# Altium schematic sheet Peripheral.SchDoc
size A3; SheetNumber: 5; SheetTotal: 6; ProjectTitle: PD_SMARTKEY_EMN-EVAN_V2
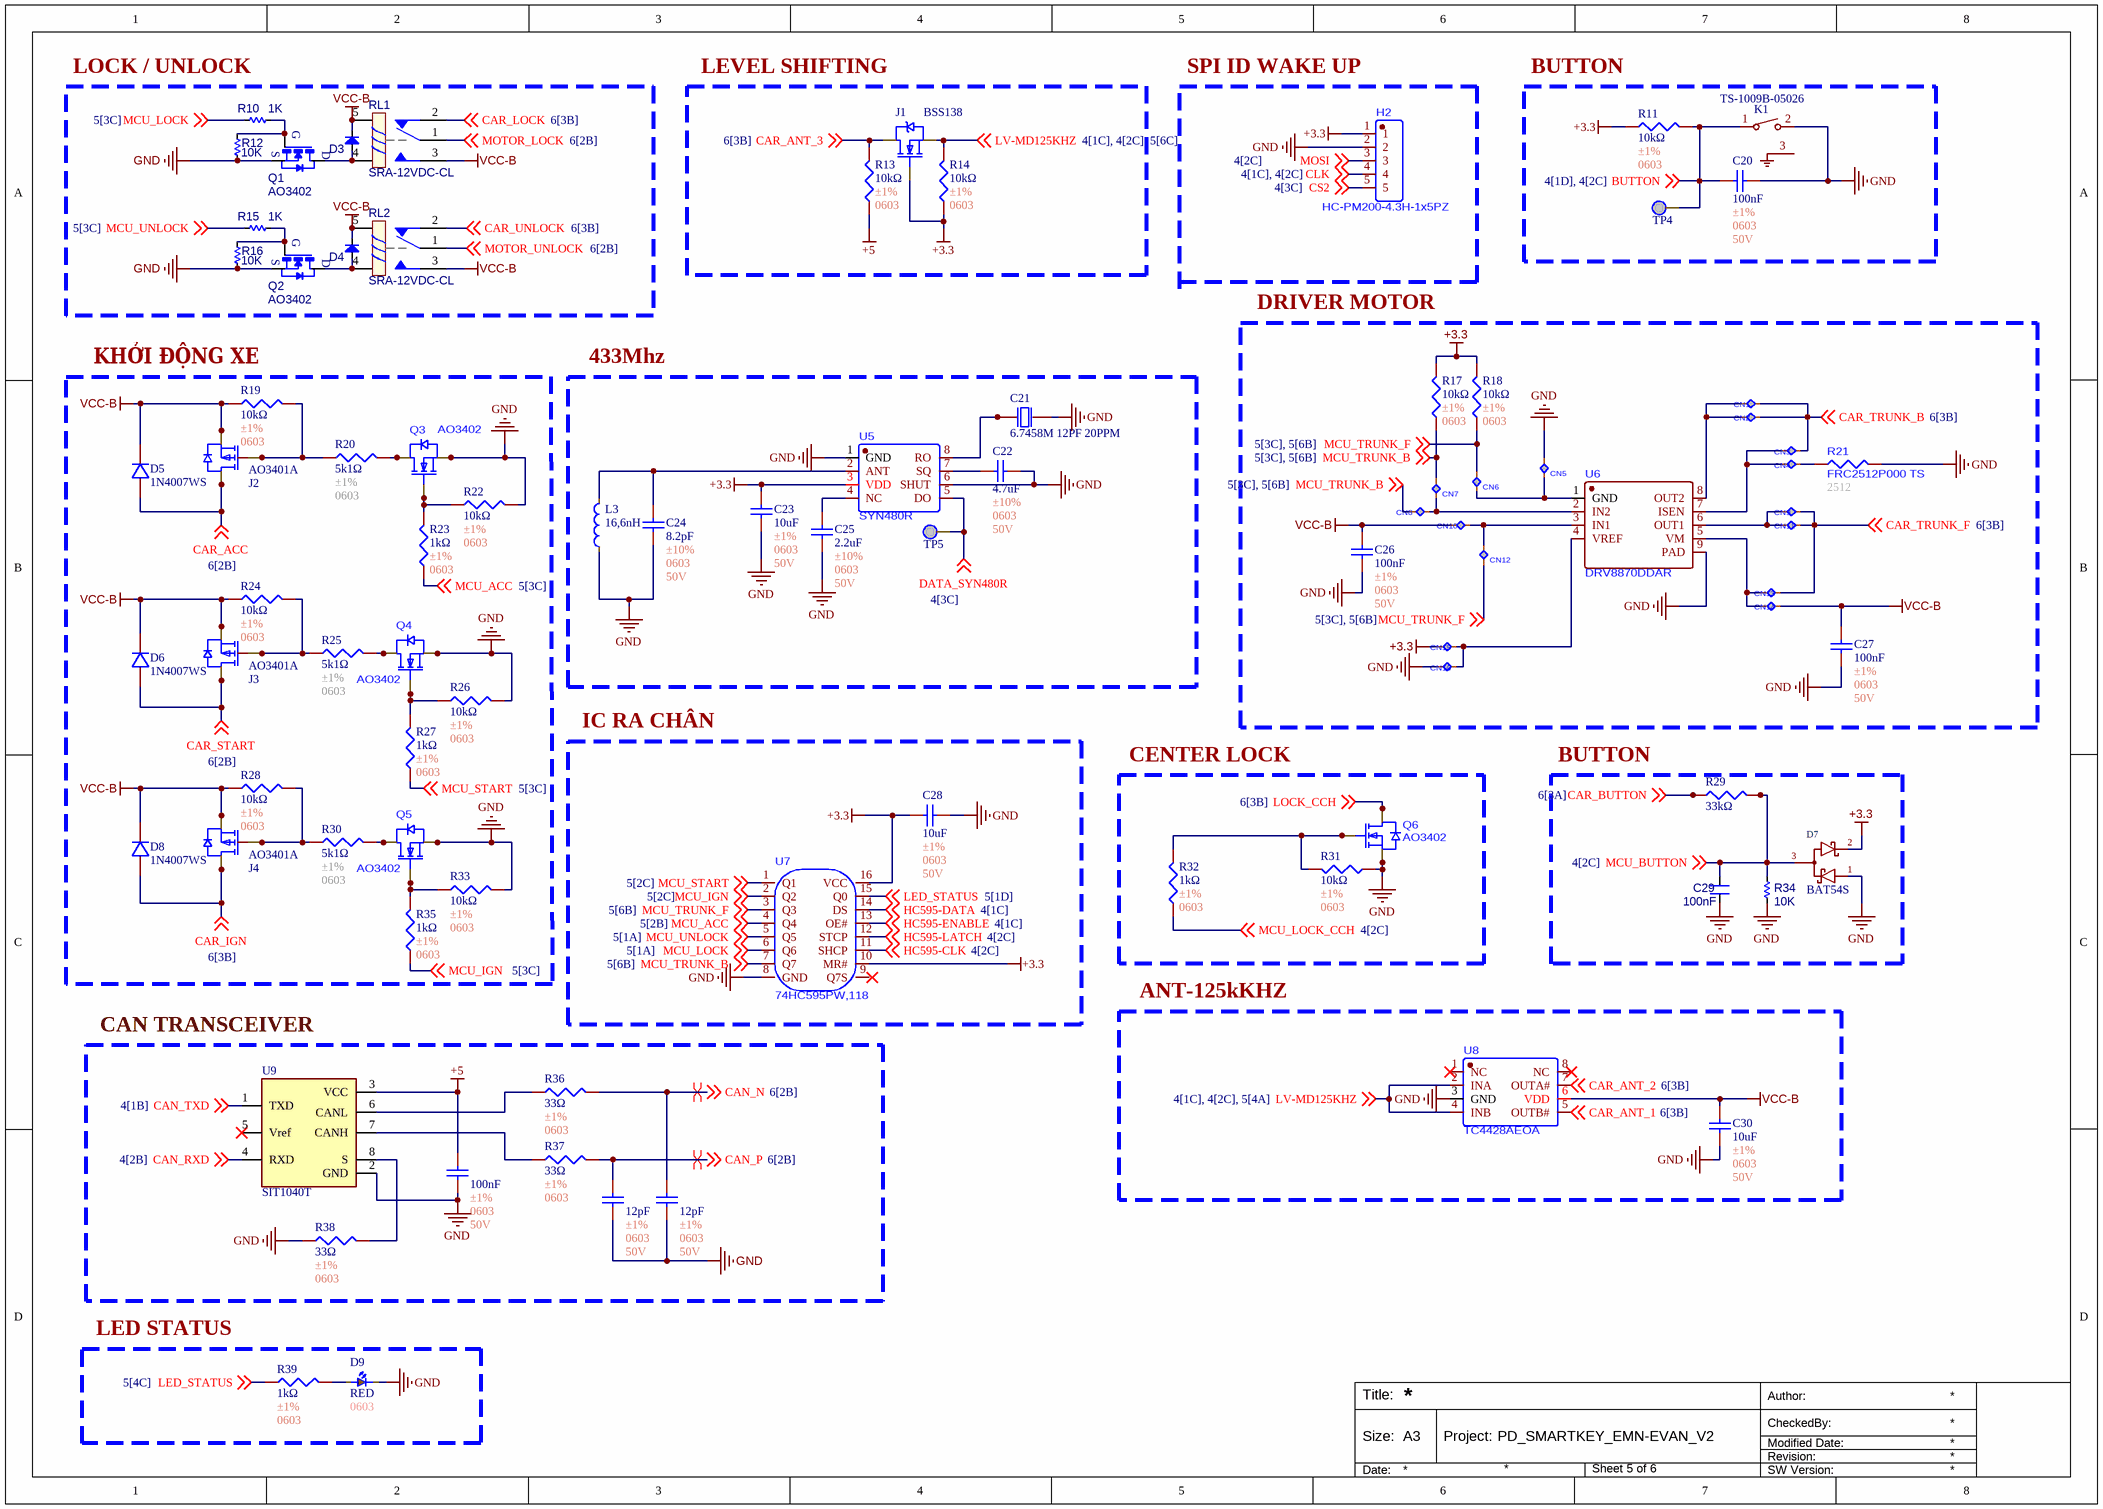
[diagram p0: Peripheral.SchDoc]

## Parts
C20  100nF  Tolerance: ±1%  Package: 0603  Voltage Rating: 50V  [C0603]
C21  6.7458M 12PF 20PPM  [6.7458M 12PF 20PPM]
C22  4.7uF  Tolerance: ±10%  Package: 0603  Voltage Rating: 50V  [C0603]
C23  10uF  Tolerance: ±1%  Package: 0603  Voltage Rating: 50V  [C0603]
C24  8.2pF  Tolerance: ±10%  Package: 0603  Voltage Rating: 50V  [C0603]
C25  2.2uF  Tolerance: ±10%  Package: 0603  Voltage Rating: 50V  [C0603]
C26  100nF  Tolerance: ±1%  Package: 0603  Voltage Rating: 50V  [C0603]
C27  100nF  Tolerance: ±1%  Package: 0603  Voltage Rating: 50V  [C0603]
C28  10uF  Tolerance: ±1%  Package: 0603  Voltage Rating: 50V  [C0603]
C29  100nF  [C-0603]
C30  10uF  Tolerance: ±1%  Package: 0603  Voltage Rating: 50V  [C0603]
C31  100nF  Tolerance: ±1%  Package: 0603  Voltage Rating: 50V  [C0603]
C32  12pF  Tolerance: ±1%  Package: 0603  Voltage Rating: 50V  [C0603]
C33  12pF  Tolerance: ±1%  Package: 0603  Voltage Rating: 50V  [C0603]
CN1  CN  [CN]  (value not drawn)
CN2  CN  [CN]  (value not drawn)
CN3  CN  [CN]  (value not drawn)
CN4  CN  [CN]  (value not drawn)
CN5  CN  [CN]  (value not drawn)
CN6  CN  [CN]  (value not drawn)
CN7  CN  [CN]  (value not drawn)
CN8  CN  [CN]  (value not drawn)
CN9  CN  [CN]  (value not drawn)
CN10  CN  [CN]  (value not drawn)
CN11  CN  [CN]  (value not drawn)
CN12  CN  [CN]  (value not drawn)
CN13  CN  [CN]  (value not drawn)
CN14  CN  [CN]  (value not drawn)
CN15  CN  [CN]  (value not drawn)
CN16  CN  [CN]  (value not drawn)
D3  1N5819  [SOD-323]  (value not drawn)
D4  1N5819  [SOD-323]  (value not drawn)
D5  1N4007WS  [1N4007WS]
D6  1N4007WS  [1N4007WS]
D7  BAT54S  [SOT23-3]
D8  1N4007WS  [1N4007WS]
D9  RED  Package: 0603  [LED0603]
H2  HC-PM200-4.3H-1x5PZ  [JC_5P_XH2.0]
J1  BSS138  [BSS138]
J2  AO3401A  [AO3401]
J3  AO3401A  [AO3401]
J4  AO3401A  [AO3401]
K1  TS-1009B-05026  [TS-1009B-05026]
L3  16,6nH  [L_16,6nH_0603]
Q1  AO3402  [SOT23-3]
Q2  AO3402  [SOT23-3]
Q3  AO3402  [AO3402]
Q4  AO3402  [AO3402]
Q5  AO3402  [AO3402]
Q6  AO3402  [AO3402]
R10  1K  [RES-SMD-0603]
R11  10kΩ  Tolerance: ±1%  Package: 0603  [R0603]
R12  10K  [RES-SMD-0603]
R13  10kΩ  Tolerance: ±1%  Package: 0603  [R0603]
R14  10kΩ  Tolerance: ±1%  Package: 0603  [R0603]
R15  1K  [RES-SMD-0603]
R16  10K  [RES-SMD-0603]
R17  10kΩ  Tolerance: ±1%  Package: 0603  [R0603]
R18  10kΩ  Tolerance: ±1%  Package: 0603  [R0603]
R19  10kΩ  Tolerance: ±1%  Package: 0603  [R0603]
R20  5k1Ω  Tolerance: ±1%  Package: 0603  [R0603]
R21  FRC2512P000 TS  Packaging: 2512  [R_2512_0O ±5%]
R22  10kΩ  Tolerance: ±1%  Package: 0603  [R0603]
R23  1kΩ  Tolerance: ±1%  Package: 0603  [R0603]
R24  10kΩ  Tolerance: ±1%  Package: 0603  [R0603]
R25  5k1Ω  Tolerance: ±1%  Package: 0603  [R0603]
R26  10kΩ  Tolerance: ±1%  Package: 0603  [R0603]
R27  1kΩ  Tolerance: ±1%  Package: 0603  [R0603]
R28  10kΩ  Tolerance: ±1%  Package: 0603  [R0603]
R29  33kΩ  [R0603]
R30  5k1Ω  Tolerance: ±1%  Package: 0603  [R0603]
R31  10kΩ  Tolerance: ±1%  Package: 0603  [R0603]
R32  1kΩ  Tolerance: ±1%  Package: 0603  [R0603]
R33  10kΩ  Tolerance: ±1%  Package: 0603  [R0603]
R34  10K  [RES-SMD-0603]
R35  1kΩ  Tolerance: ±1%  Package: 0603  [R0603]
R36  33Ω  Tolerance: ±1%  Package: 0603  [R0603]
R37  33Ω  Tolerance: ±1%  Package: 0603  [R0603]
R38  33Ω  Tolerance: ±1%  Package: 0603  [R0603]
R39  1kΩ  Tolerance: ±1%  Package: 0603  [R0603]
RL1  SRA-12VDC-CL  [YL318-DC12V-C]
RL2  SRA-12VDC-CL  [YL318-DC12V-C]
TP4  TP  [TP]  (value not drawn)
TP5  TP  [TP]  (value not drawn)
U5  SYN480R  [SYN480R]
U6  DRV8870DDAR  [DRV8870DDAR]
U7  74HC595PW,118  [74HC595PW,118]
U8  TC4428AEOA  [TC4428AEOA]
U9  SIT1040T  [SO8]

## Blocks framed on the sheet
LOCK / UNLOCK: D3 D4 Q1 Q2 R10 R12 R15 R16 RL1 RL2
LEVEL SHIFTING: J1 R13 R14
BUTTON: C20 K1 R11 TP4
DRIVER MOTOR: C26 C27 CN1-CN16 R17 R18 R21 U6
KHỞI ĐỘNG XE: D5 D6 D8 J2-J4 Q3-Q5 R19 R20 R22-R28 R30 R33 R35
433Mhz: C21-C25 L3 TP5 U5
IC RA CHÂN: C28 U7
CENTER LOCK: Q6 R31 R32
BUTTON: C29 D7 R29 R34
ANT-125kKHZ: C30 U8
CAN TRANSCEIVER: C31-C33 R36-R38 U9

## Nets
+3.3: C23.1 C28.1 CN15.1 D7.2(C) H2.1 J1.1(G) R11.1 R14.1 R17.2 R18.2 U5.3(VDD) U7.10(MR#) U7.16(VCC)
+5: C31.1 R13.1 U9.3(VCC)
GND: C20.1 C21.2(OSC2) C22.2 C23.2 C24.2 C25.2 C26.2 C27.2 C28.2 C29.1 C30.2 C31.2 C32.2 C33.2 CN5.1 CN16.1 D7.1(A) D9.1 H2.2 K1.2 L3.1 Q1.2(S) Q2.2(S) Q3.2(S) Q4.2(S) Q5.2(S) Q6.2(S) R12.1 R16.1 R21.2 R22.2 R26.2 R31.1 R33.2 R34.1 R38.1 U5.1(GND) U5.6(SHUT) U6.9(PAD) U7.8(GND) U8.3(GND) U9.2(GND)
VCC-B: C26.1 C27.1 C30.1 CN10.1 CN14.2 D3.2(K) D4.2(K) D5.1(K) D6.1(K) D8.1(K) J2.2(S) J3.2(S) J4.2(S) R19.1 R24.1 R28.1 RL1.3 RL1.5 RL2.3 RL2.5 U8.6(VDD)
BUTTON: C20.2 K1.1 R11.2 TP4.1 ; off-sheet BUTTON
CAN_N: C33.1 R36.2 ; off-sheet CAN_N
CAN_P: C32.1 R37.2 ; off-sheet CAN_P
CAN_RXD: U9.4(RXD) ; off-sheet CAN_RXD
CAN_TXD: U9.1(TXD) ; off-sheet CAN_TXD
CAR_ACC: D5.2(A) J2.3(D) ; off-sheet CAR_ACC
CAR_ANT_1: U8.5(OUTB#) ; off-sheet CAR_ANT_1
CAR_ANT_2: U8.7(OUTA#) ; off-sheet CAR_ANT_2
CAR_ANT_3: J1.3(D) R13.2 ; off-sheet CAR_ANT_3
CAR_BUTTON: R29.1 ; off-sheet CAR_BUTTON
CAR_IGN: D8.2(A) J4.3(D) ; off-sheet CAR_IGN
CAR_LOCK: RL1.2 ; off-sheet CAR_LOCK
CAR_START: D6.2(A) J3.3(D) ; off-sheet CAR_START
CAR_TRUNK_B: CN1.2 CN2.2 CN3.2 ; off-sheet CAR_TRUNK_B
CAR_TRUNK_F: CN9.2 CN11.2 CN13.2 ; off-sheet CAR_TRUNK_F
CAR_UNLOCK: RL2.2 ; off-sheet CAR_UNLOCK
CLK: H2.4 ; off-sheet CLK
CS2: H2.5 ; off-sheet CS2
DATA_SYN480R: TP5.1 U5.5(DO) ; off-sheet DATA_SYN480R
HC595-CLK: U7.11(SHCP) ; off-sheet HC595-CLK
HC595-DATA: U7.14(DS) ; off-sheet HC595-DATA
HC595-ENABLE: U7.13(OE#) ; off-sheet HC595-ENABLE
HC595-LATCH: U7.12(STCP) ; off-sheet HC595-LATCH
LED_STATUS: R39.1 U7.15(Q0) ; off-sheet LED_STATUS
LOCK_CCH: Q6.3(D) ; off-sheet LOCK_CCH
LV-MD125KHZ: J1.2(S) R14.2 U8.2(INA) U8.4(INB) ; off-sheet LV-MD125KHZ
MCU_ACC: R23.1 U7.4(Q4) ; off-sheet MCU_ACC
MCU_BUTTON: C29.2 D7.3 R29.2 R34.2 ; off-sheet MCU_BUTTON
MCU_IGN: R35.1 U7.2(Q2) ; off-sheet MCU_IGN
MCU_LOCK: R10.2 U7.6(Q6) ; off-sheet MCU_LOCK
MCU_LOCK_CCH: R32.1 ; off-sheet MCU_LOCK_CCH
MCU_START: R27.1 U7.1(Q1) ; off-sheet MCU_START
MCU_TRUNK_B: CN7.1 CN8.1 R17.1 U7.7(Q7) ; off-sheet MCU_TRUNK_B
MCU_TRUNK_F: CN6.1 CN12.1 R18.1 U7.3(Q3) ; off-sheet MCU_TRUNK_F
MCU_UNLOCK: R15.2 U7.5(Q5) ; off-sheet MCU_UNLOCK
MOSI: H2.3 ; off-sheet MOSI
MOTOR_LOCK: RL1.1 ; off-sheet MOTOR_LOCK
MOTOR_UNLOCK: RL2.1 ; off-sheet MOTOR_UNLOCK
NetC21_1: C21.1(OSC1) U5.8(RO)
NetC22_1: C22.1 U5.7(SQ)
NetC24_1: C24.1 L3.2 U5.2(ANT)
NetC25_1: C25.1 U5.4(NC)
NetCN1_1: CN1.1 CN2.1 U6.8(OUT2)
NetCN3_1: CN3.1 CN4.1 U6.7(ISEN)
NetCN4_2: CN4.2 R21.1
NetCN5_2: CN5.2 CN6.2 U6.1(GND)
NetCN7_2: CN7.2 CN8.2 U6.2(IN2)
NetCN9_1: CN9.1 CN11.1 U6.6(OUT1)
NetCN10_2: CN10.2 CN12.2 U6.3(IN1)
NetCN13_1: CN13.1 CN14.1 U6.5(VM)
NetCN15_2: CN15.2 CN16.2 U6.4(VREF)
NetD3_1: D3.1(A) Q1.3(D) RL1.4
NetD4_1: D4.1(A) Q2.3(D) RL2.4
NetD9_2: D9.2 R39.2
NetJ2_1: J2.1(G) R19.2 R20.1
NetJ3_1: J3.1(G) R24.2 R25.1
NetJ4_1: J4.1(G) R28.2 R30.1
NetQ1_1: Q1.1(G) R10.1 R12.2
NetQ2_1: Q2.1(G) R15.1 R16.2
NetQ3_1: Q3.1(G) R22.1 R23.2
NetQ3_3: Q3.3(D) R20.2
NetQ4_1: Q4.1(G) R26.1 R27.2
NetQ4_3: Q4.3(D) R25.2
NetQ5_1: Q5.1(G) R33.1 R35.2
NetQ5_3: Q5.3(D) R30.2
NetQ6_1: Q6.1(G) R31.2 R32.2
NetR36_1: R36.1 U9.6(CANL)
NetR37_1: R37.1 U9.7(CANH)
NetR38_2: R38.2 U9.8(S)

Not connected (* = marked no-connect by the designer): K1 3; U7 9(Q7S); U8 1(NC)* 8(NC)*; U9 5(Vref)*

## Layout directives
differential pair: CAN_N, CAN_P

## Notes on the sheet
- SPI ID WAKE UP
- LED STATUS
- Author:
- Title:
- Size:
- A3
- Project:
- Revision:
- Modified Date:
- CheckedBy:
- Date:
- SW Version:

## Library data of the parts
C20 C26 C27 = C0603_100nF_±1%: Manufacturer: YAGEO; Mfr. Part #: CC0402FRNPO9BN100; LCSC Part #: C513681; Link: https://www.lcsc.com/product-detail/C513681.html?s_z=n_capital%2520yageo%252010pF%25200402; Capacitance: 100nF
C21 = 6.7458M 12PF 20PPM: CRYSTAL 6.7458MHz 12pF SMD; Manufacturer: SOSET; Load Capacitance: 20pF; Mfr. Part #: 6.7458M 12PF 20PPM; LCSC Part #: C4944008; Package: HC-49S-SMD-2P-Mini; Link: https://www.lcsc.com/product-detail/C4944008.html?utm_source=chatgpt.com
C22 = C0603_4.7uF_±10%: Manufacturer: muRata; Mfr. Part #: GCJ188C70J335KE02D; Temperature Coefficient: X7S; LCSC Part #: C710616; Link: https://www.lcsc.com/product-detail/C710616.html?s_z=n_Capita%25200603%25203.3uF%2520yageo; Capacitance: 4.7uF
C23 C28 C30 = C0603_10uF_±1%: Manufacturer: YAGEO; Mfr. Part #: CC0402FRNPO9BN100; LCSC Part #: C513681; Link: https://www.lcsc.com/product-detail/C513681.html?s_z=n_capital%2520yageo%252010pF%25200402; Capacitance: 10uF
C24 = C0603_8.2pF_±10%: Manufacturer: muRata; Mfr. Part #: GCJ188C70J335KE02D; Temperature Coefficient: X7S; LCSC Part #: C710616; Link: https://www.lcsc.com/product-detail/C710616.html?s_z=n_Capita%25200603%25203.3uF%2520yageo; Capacitance: 8.2pF
C25 = C0603_2.2uF_±10%: Manufacturer: muRata; Mfr. Part #: GCJ188C70J335KE02D; Temperature Coefficient: X7S; LCSC Part #: C710616; Link: https://www.lcsc.com/product-detail/C710616.html?s_z=n_Capita%25200603%25203.3uF%2520yageo; Capacitance: 2.2uF
C29 = CM: Cap SMD; Value: 103
C31 = C0603_100nF_±1%: 50V 10pF NP0 ±1% 0402 Multilayer Ceramic Capacitors MLCC - SMD/SMT ROHS; Manufacturer: YAGEO; Mfr. Part #: CC0402FRNPO9BN100; LCSC Part #: C513681; Link: https://www.lcsc.com/product-detail/C513681.html?s_z=n_capital%2520yageo%252010pF%25200402; Capacitance: 100nF
C32 C33 = C0603_12pF_±1%: 50V 10pF NP0 ±1% 0402 Multilayer Ceramic Capacitors MLCC - SMD/SMT ROHS; Manufacturer: YAGEO; Mfr. Part #: CC0402FRNPO9BN100; LCSC Part #: C513681; Link: https://www.lcsc.com/product-detail/C513681.html?s_z=n_capital%2520yageo%252010pF%25200402; Capacitance: 12pF
D3 D4 = Diode SMD: Default Diode; Code - JEDEC: DO-214-AB; Value: 1N5007; Published: 8-Jun-2000; Revision: July-2002: Re-released for DXP Platform.; Publisher: Altium Limited
D5 D6 D8 = 1N4007WS: DIODE STANDARD 1kV 1A SOD-323; Manufacturer: MDD(Microdiode Semiconductor); Mfr. Part #: 1N4007WS; LCSC Part #: C193404; Package: SOD-323; Link: https://www.lcsc.com/product-detail/C193404.html?utm_source=chatgpt.com
D7 = Schottky Dual Diode SMD: Diode 30V 0.2A Surface Mount SOT-23; ki_keywords: Dual Schottky Diode Series; ki_description: Dual Schottky Diode in Series; Datasheet: https://diotec.com/request/datasheet/bat54.pdf
D9 = D0603_RED: 25mcd~40mcd Water Clear -40℃~+85℃ 624nm Red 120° 60mW 0402 LED Indication - Discrete ROHS; Manufacturer: XINGLIGHT; Mfr. Part #: XL-1005UGC; Voltage - Forward(Vf): 3V; LCSC Part #: C965793; Power(Watts): 60mW; Link: https://www.lcsc.com/product-detail/C136765.html?s_z=n_LED%25200402%2520RED; Illumination Color: RED
H2 = JC_5P_XH2.0X_: CONN SOCKET 5POS 2mm SINGLE ROW TH; Manufacturer: Hong Cheng; MPN: HC-PM200-4.3H-1x5PZ; LCSC Part #: C22436139; Packaging: Through Hole,P=2mm; Link: https://www.lcsc.com/product-detail/C22436139.html?utm_source=chatgpt.com
J1 = BSS138: MOSFET N-CH 50V 0.22A SOT-23; Manufacturer: onsemi; Mfr. Part #: BSS138; LCSC Part #: C52895; Package: SOT-23; Link: https://www.lcsc.com/product-detail/C52895.html?s_z=n_q_x_bss138&spm=wm.ssy.em.0.tz&lcsc_vid=FFlaVlZURFlbX1EAE1lbUlZfQwdeBlBRQ1VZBFdQQwUxVlNeQlVeVVZeQlBWUTsOAxUeFF5JWBYZEEoKFBINSQcJGk4eFQsCAgIaSgADAwAHC0slTlBeX1dIHxUDCw%3D%3D
J2-J4 = AO3401: 30V 4A 900mV@250uA 1 P-Channel SOT-23 MOSFETs ROHS; Manufacturer: AOS; Mfr. Part #: AO3401A; LCSC Part #: C15127; Package: SOT-23; Current - Continuous Drain(Id): 4A; Drain to Source Voltage: 30V; Link: https://www.lcsc.com/product-detail/C15127.html?s_z=n_AO3401
K1 = TS-1009B-05026: SWITCH TACTILE SPST TH R/A; Manufacturer: XUNPU; Mfr. Part #: TS-1009B-05026; LCSC Part #: C455252; Package: Through Hole,Right Angle,4.5x4.5mm; Link: https://www.lcsc.com/product-detail/Tactile-Switches_XUNPU_C455252.html?utm_source=chatgpt.com
L3 = L_0603_16.6nH: 700mA 16nH ±5% 170mΩ Wire-wound inductor 0603 Fixed Inductors; Manufacturer: Coilank; Mfr. Part #: HWC1608J16ND; LCSC Part #: C54534274; Package: 0603; Link: https://www.lcsc.com/product-detail/C54534274.html?s_z=n_q_0603%252016nH&spm=wm.fly.bg.0.xh&lcsc_vid=FlRcBlcDRFNZAlJQT1RZBVJSEVFcX11eRVQPBFEHFgAxVlNeQFZdV1BVRFZWVjsOAxUeFF5JWBYZEEoKFBINSQcJGk4NBhADEA4cHktXRllfSQwSGg0%3D; Inductance: 16,6nH
Q1 Q2 = SI2302DS: N-Channel 20V 2.5A _Tc_ 830mW _Tc_ Surface Mount TO-236AB _SOT23_; MF: NXP Semiconductors; SnapEDA_Link: https://www.snapeda.com/parts/SI2302DS/NXP%20Semiconductors/view-part/4701514/?ref=snap; Availability: Unavailable; MP: SI2302DS; Price: None; Value: *; Package: None
Q3-Q6 = AO3402: MOSFET N-CH 30V SOT-23; Manufacturer: AOS; MPN: AO3402; LCSC Part #: C14385; Packaging: SOT-23; Link: https://www.lcsc.com/product-detail/C14385.html?s_z=n_q_ao3402&spm=wm.fly.bg.0.xh&lcsc_vid=FFlaVlZURFlbX1EAE1lbUlZfQwdeBlBRQ1VZBFdQQwUxVlNeRVZXVF1QQ1BYXzsOAxUeFF5JWBYZEEoKFBINSQcJGk4NBhADEA4cHktXR1FWSQwSGg0%3D
R10 R12 R15 R16 R34 = Res-SMD: Resistor; Manufacturer: Generic Components; Class: Passive; Published: 08/06/2000; Publisher: Altium Hobart Technology Centre
R11 R13 R14 R17-R19 R22 R24 R26 R28 R31 R33 = R0603_10kΩ_±1%: 62.5mW Thick Film Resistor 50V ±1% ±200ppm/℃ 10Ω 0402 Chip Resistor - Surface Mount ROHS; Manufacturer: YAGEO; Mfr. Part #: RC0402FR-0710RL; LCSC Part #: C138066; Resistance: 10kΩ; Link: https://www.lcsc.com/product-detail/C138066.html?s_z=n_resistor%25200402%252010R
R20 R25 R30 = R0603_5k1Ω_±1%: 100mW Thick Film Resistor 75V ±100ppm/℃ ±1% 5.1kΩ 0603 Chip Resistor - Surface Mount ROHS; Manufacturer: FOJAN; Mfr. Part #: FRC0603F5101TS; Key Attributes: RES 5.1kΩ ±1% 100mW 0603; LCSC Part #: C2907044; Link: https://www.lcsc.com/product-detail/C2907044.html?s_z=n_5k1%25200603; Resistance: 5k1Ω
R21 = R_2512_0Ω ±5%: RES 0Ω ±5% 1W 2512; Manufacturer: FOJAN; MPN: FRC2512P000 TS; LCSC Part #: C2907567; Link: https://www.lcsc.com/product-detail/C2907567.html?s_z=n_q_t_2512%25200R&spm=wm.fly.bg.0.xh___wm.ssy.tc.0.tz&lcsc_vid=FlRcBlcDRFNZAlJQT1RZBVJSEVFcX11eRVQPBFEHFgAxVlNeT1VcVV1UR1dZVTsOAxUeFF5JWBYZEEoKFBINSQcJGk4eFQsCAgIaSgADAwAHC0slT1dbXlRIHxUDCw%3D%3D
R23 R27 R32 R35 R39 = R0603_1kΩ_±1%: 62.5mW Thick Film Resistor 50V ±1% ±200ppm/℃ 10Ω 0402 Chip Resistor - Surface Mount ROHS; Manufacturer: YAGEO; Mfr. Part #: RC0402FR-0710RL; LCSC Part #: C138066; Resistance: 1kΩ; Link: https://www.lcsc.com/product-detail/C138066.html?s_z=n_resistor%25200402%252010R
R29 = R0603_33kΩ_±1%: Manufacturer: YAGEO; Resistance: 33kΩ
R36-R38 = R0603_33Ω_±5%: 100mW Thick Film Resistor 75V ±1% ±200ppm/℃ 2Ω 0603 Chip Resistor - Surface Mount ROHS; Manufacturer: YAGEO; Mfr. Part #: RC0603FR-072RL; Key Attributes: RES 0Ω ±5% 100mW 0603; LCSC Part #: C185341; Resistance: 33Ω; Link: https://www.lcsc.com/product-detail/C185341.html?s_z=n_resistor%2520yageo%25202%25CE%25A9%25200603
RL1 RL2 = Relay 1: Relay SPDT,10A - 12VDC 5 Pin; Value: Relay SPDT, 10A, 12V
U5 = SYN480R: 433/315 MHz wireless receiver chips; Manufacturer: JSMSEMI; MPN: SYN480R; LCSC Part #: C916347; Packaging: SOP-8; Link: https://www.lcsc.com/product-detail/C916347.html?s_z=n_q_SYN480R&spm=wm.fly.bg.0.xh&lcsc_vid=FlRcBlcDRFNZAlJQT1RZBVJSEVFcX11eRVQPBFEHFgAxVlNeQVVdUFxQR1VXUDsOAxUeFF5JWBYZEEoKFBINSQcJGk4eFQsCAgIaSgADAwAHC0sRHhMLShAJWgMBBhYCWgIBCQoDFBUBFTsLEgYPFBAHBUwUH0kODlNDV0lVBxYaOCdRQ1NXUlNWWQkaCgg%3D
U6 = DRV8870DDAR: Brushed DC motor driver (PWM control); Manufacturer: TI; MPN: DRV8870DDAR; LCSC Part #: C86590; Packaging: HSOP-8-EP; Link: https://www.lcsc.com/product-detail/C86590.html?s_z=n_q_DRV8870&spm=wm.fly.bg.1.xh&lcsc_vid=FlRcBlcDRFNZAlJQT1RZBVJSEVFcX11eRVQPBFEHFgAxVlNeT1VcV1ZUQVZXXzsOAxUeFF5JWBYZEEoKFBINSQcJGk4%3D
U7 = 74HC595PW,118: 8-bit serial-in, serial or parallel-out shift register with output latches; 3-state; Manufacturer: Nexperia; MPN: 74HC595PW,118; LCSC Part #: C5948; Packaging: TSSOP-16; Link: https://www.lcsc.com/product-detail/C5948.html?utm_source=chatgpt.com
U8 = TC4428AEOA: 1.5A Dual High-Speed Power MOSFET Drivers; Manufacturer: MICROCHIP; MPN: TC4428AEOA; LCSC Part #: C636894; Packaging: SOIC-8; Link: https://www.lcsc.com/product-detail/C636894.html?s_z=n_q_TC4428AE&spm=wm.fly.bg.3.xh&lcsc_vid=FlRcBlcDRFNZAlJQT1RZBVJSEVFcX11eRVQPBFEHFgAxVlNeT1VdVVVeQ1FZUjsOAxUeFF5JWBYZEEoKFBINSQcJGk4NBhADEA4cHktXR1NXSQwSGg0%3D
U9 = TJA1050: 1/1 Transceiver Half CANbus 8-SO; MF: NXP USA; Package: SOIC-8 NXP USA; Value: *; Availability: Unavailable; SnapEDA_Link: https://www.snapeda.com/parts/TJA1050/NXP%20USA%20Inc./view-part/562764/?ref=snap; Price: None; MP: TJA1050